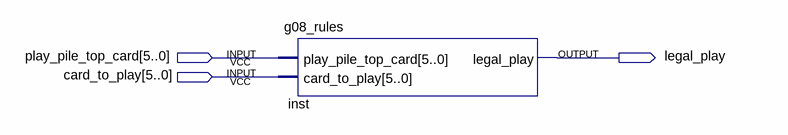
[diagram p0: schematic sheet]
// Quartus schematic g08_lab4.bdf as structural Verilog: 1 symbols, 3 pins
module g08_lab4 (
  input  [5:0] play_pile_top_card,
  input  [5:0] card_to_play,
  output legal_play
);

  g08_rules inst (.play_pile_top_card(play_pile_top_card), .card_to_play(card_to_play), .legal_play(legal_play));
endmodule
